# EAGLE design kompass6 (EAGLE 4.16)
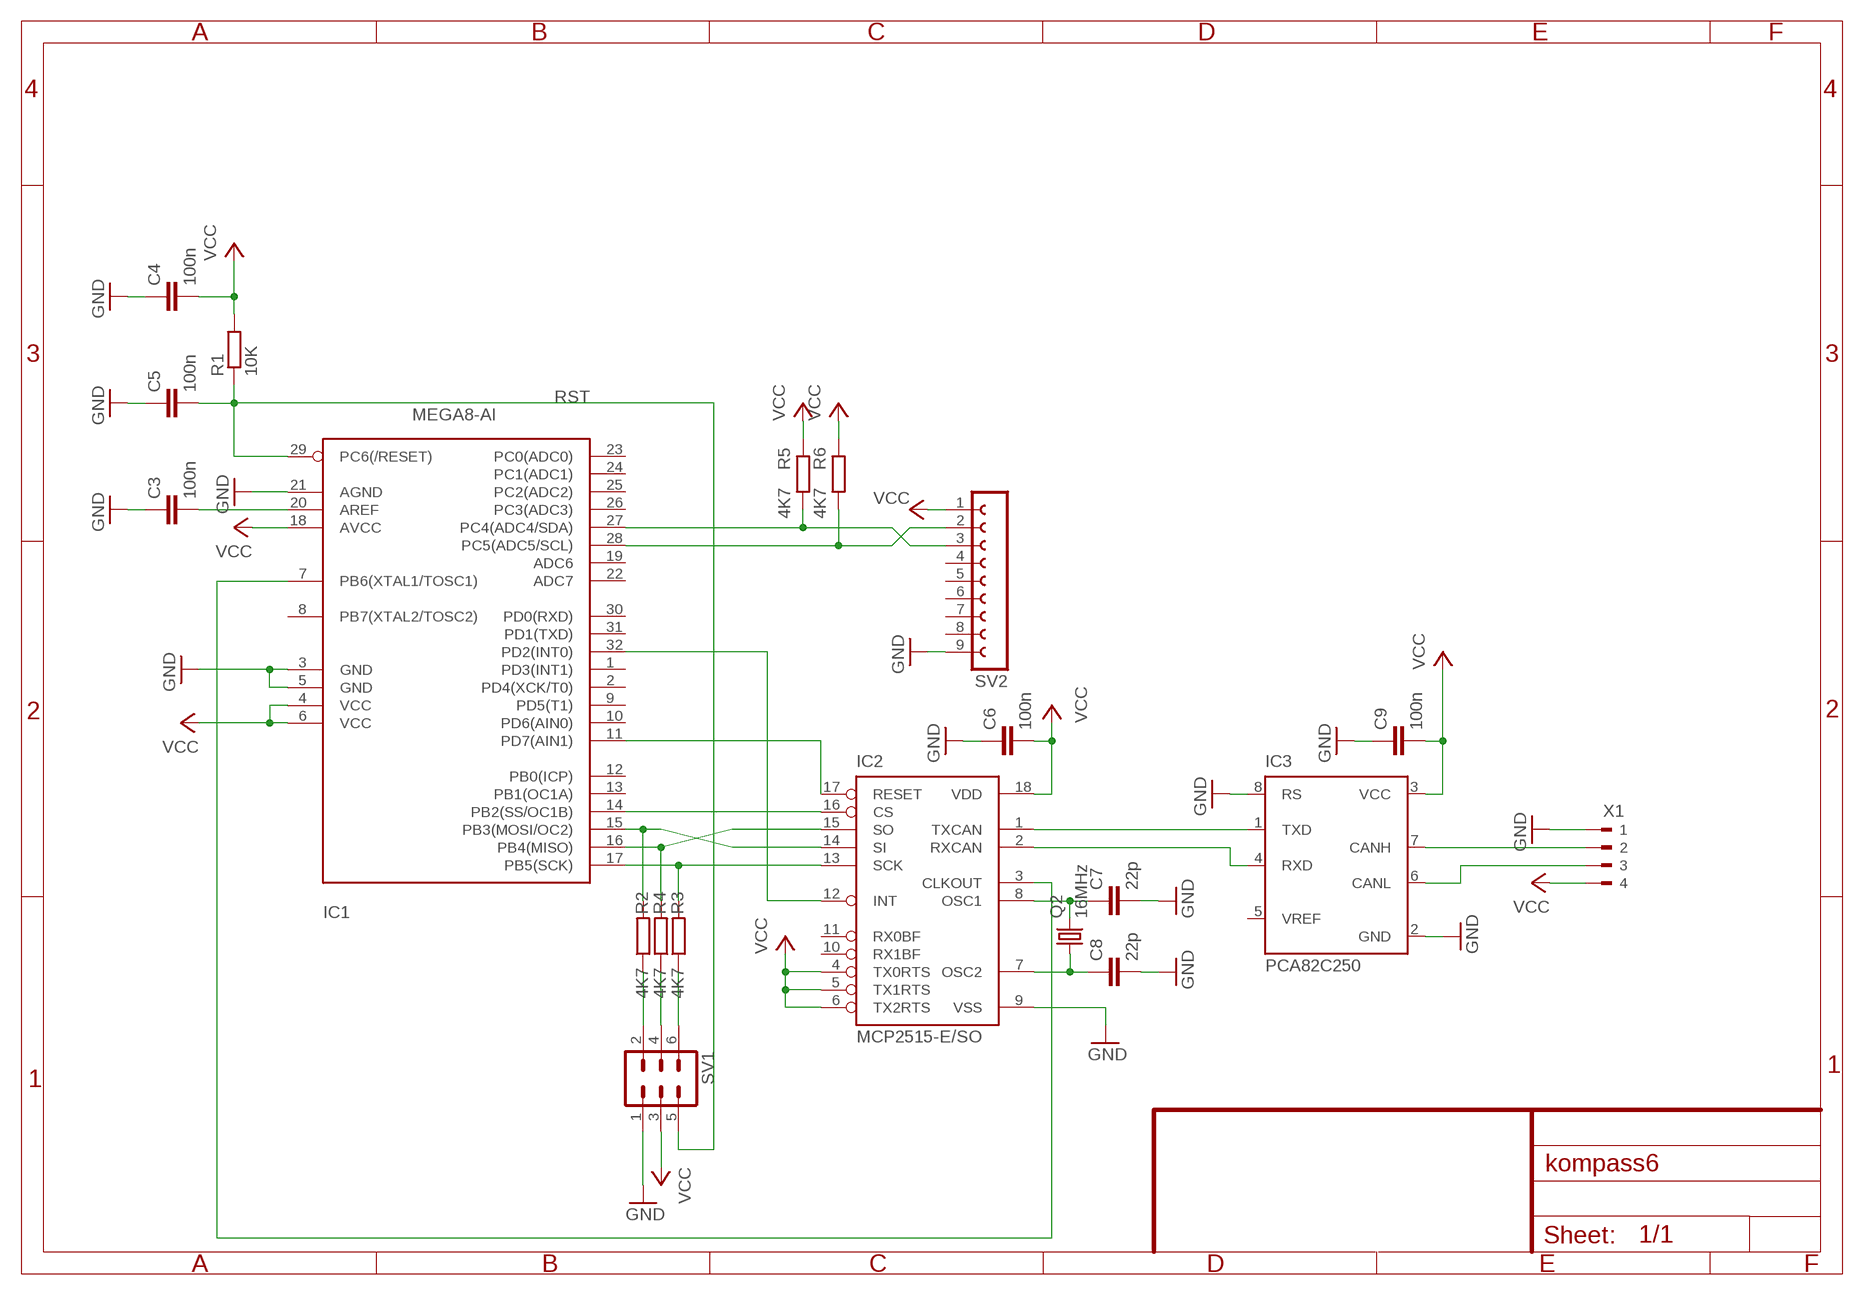
[diagram p0: schematic, sheet 1]

## Parts
C3  100n  C-EUC0603  [C0603]
C4  100n  C-EUC0603  [C0603]
C5  100n  C-EUC0603  [C0603]
C6  100n  C-EUC0603  [C0603]
C7  22p  C-EUC0603  [C0603]
C8  22p  C-EUC0603  [C0603]
C9  100n  C-EUC0603  [C0603]
IC1  MEGA8-AI  [TQFP32-08]
IC2  MCP2515-E/SO  [SO18L]
IC3  PCA82C250  [DIL08]
Q2  16MHz  CRYSTALHC49U-V  [HC49U-V]
R1  10K  R-EU_R0805  [R0805]
R2  4K7  R-EU_R0805  [R0805]
R3  4K7  R-EU_R0805  [R0805]
R4  4K7  R-EU_R0805  [R0805]
R5  4K7  R-EU_R0805  [R0805]
R6  4K7  R-EU_R0805  [R0805]
SV1  MA03-2  [MA03-2]
SV2  FE09-1  [FE09]
X1  90-4  [90-4]

## Nets
GND: C3.1 C4.1 C5.1 C6.1 C7.2 C8.2 C9.1 IC1.3(GND) IC1.5(GND) IC1.21(AGND) IC2.9(VSS) IC3.2(GND) IC3.8(RS) SV1.1 SV2.9 X1.1
INT: IC1.32(PD2(INT0)) IC2.12(INT)
MISO: IC1.16(PB4(MISO)) IC2.15(SO) R4.2
MOSI: IC1.15(PB3(MOSI/OC2)) IC2.14(SI) R2.2
N$1: IC3.7(CANH) X1.2
N$2: IC3.6(CANL) X1.3
N$5: C3.2 IC1.20(AREF)
N$6: IC1.11(PD7(AIN1)) IC2.17(RESET)
N$8: IC1.7(PB6(XTAL1/TOSC1)) IC2.3(CLKOUT)
N$11: IC2.1(TXCAN) IC3.1(TXD)
N$12: IC2.2(RXCAN) IC3.4(RXD)
N$13: C7.1 IC2.8(OSC1) Q2.2
N$14: C8.1 IC2.7(OSC2) Q2.1
N$15: R2.1 SV1.2
N$16: R3.1 SV1.6
N$17: R4.1 SV1.4
RST: C5.2 IC1.29(PC6(/RESET)) R1.1 SV1.5
SCK: IC1.17(PB5(SCK)) IC2.13(SCK) R3.2
SCL: IC1.28(PC5(ADC5/SCL)) R6.1 SV2.2
SDA: IC1.27(PC4(ADC4/SDA)) R5.1 SV2.3
SS: IC1.14(PB2(SS/OC1B)) IC2.16(CS)
VCC: C4.2 C6.2 C9.2 IC1.4(VCC) IC1.6(VCC) IC1.18(AVCC) IC2.4(TX0RTS) IC2.5(TX1RTS) IC2.6(TX2RTS) IC2.18(VDD) IC3.3(VCC) R1.2 R5.2 R6.2 SV1.3 SV2.1 X1.4
Unconnected: IC1.1(PD3(INT1)) IC1.2(PD4(XCK/T0)) IC1.8(PB7(XTAL2/TOSC2)) IC1.9(PD5(T1)) IC1.10(PD6(AIN0)) IC1.12(PB0(ICP)) IC1.13(PB1(OC1A)) IC1.19(ADC6) IC1.22(ADC7) IC1.23(PC0(ADC0)) IC1.24(PC1(ADC1)) IC1.25(PC2(ADC2)) IC1.26(PC3(ADC3)) IC1.30(PD0(RXD)) IC1.31(PD1(TXD)) IC2.10(RX1BF) IC2.11(RX0BF) IC3.5(VREF) SV2.4 SV2.5 SV2.6 SV2.7 SV2.8

## Library data of the parts
C3-C9 = rcl:C-EU: CAPACITOR, European symbol
IC1 = atmel:MEGA8: MICROCONTROLLER 8 Kbytes FLASH 1 kbytes SRAM 512 bytes EEPROM USART 6-channel 10 bit ADC 2-channel 8 bit ADC Source: avr.lbr
IC2 = mcp2515:MCP2515
IC3 = micro-philips:PCA82C250: CAN CONTROLLER INTERFACE
Q2 = crystal:CRYSTAL: CRYSTAL
R1-R6 = rcl:R-EU_: RESISTOR, European symbol
SV1 = con-lstb:MA03-2: PIN HEADER
SV2 = con-lsta:FE09-1: FEMALE HEADER
X1 = con-weidmueller-sl35:90-4: WEIDMUELLER CLAMP CONNECTOR

## Board
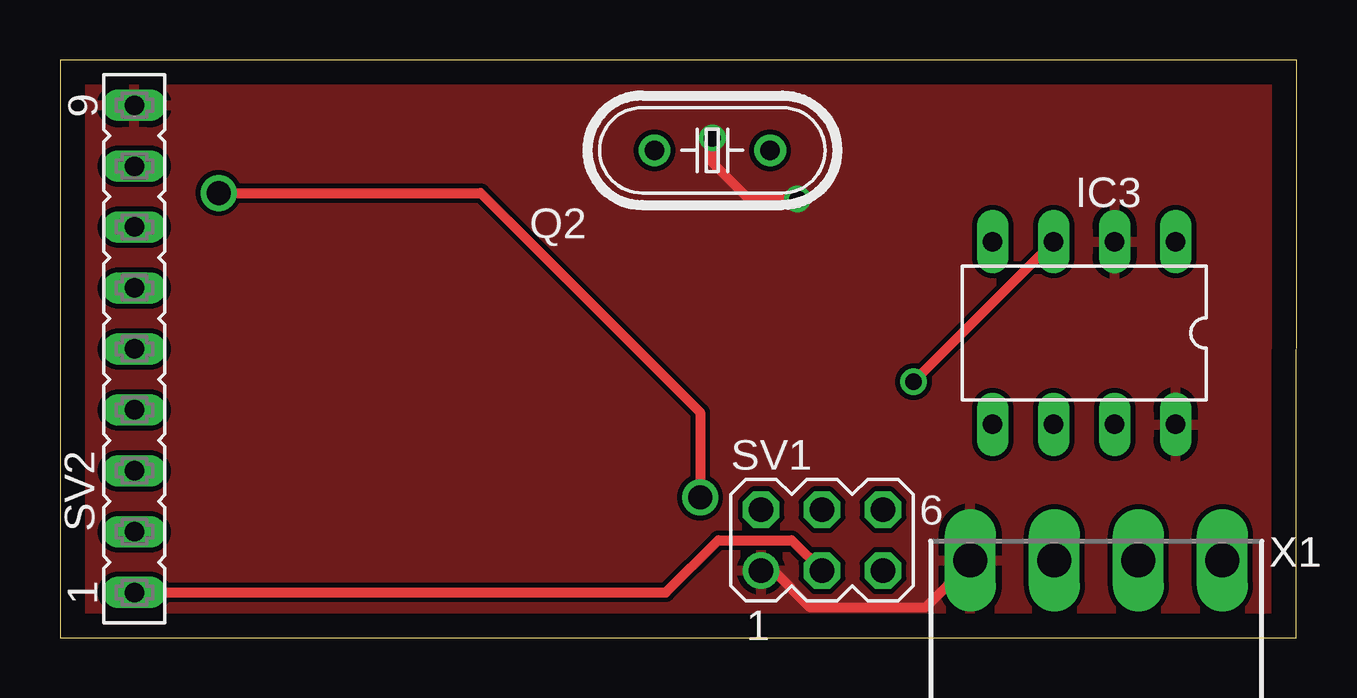
[diagram p1: board, top side]
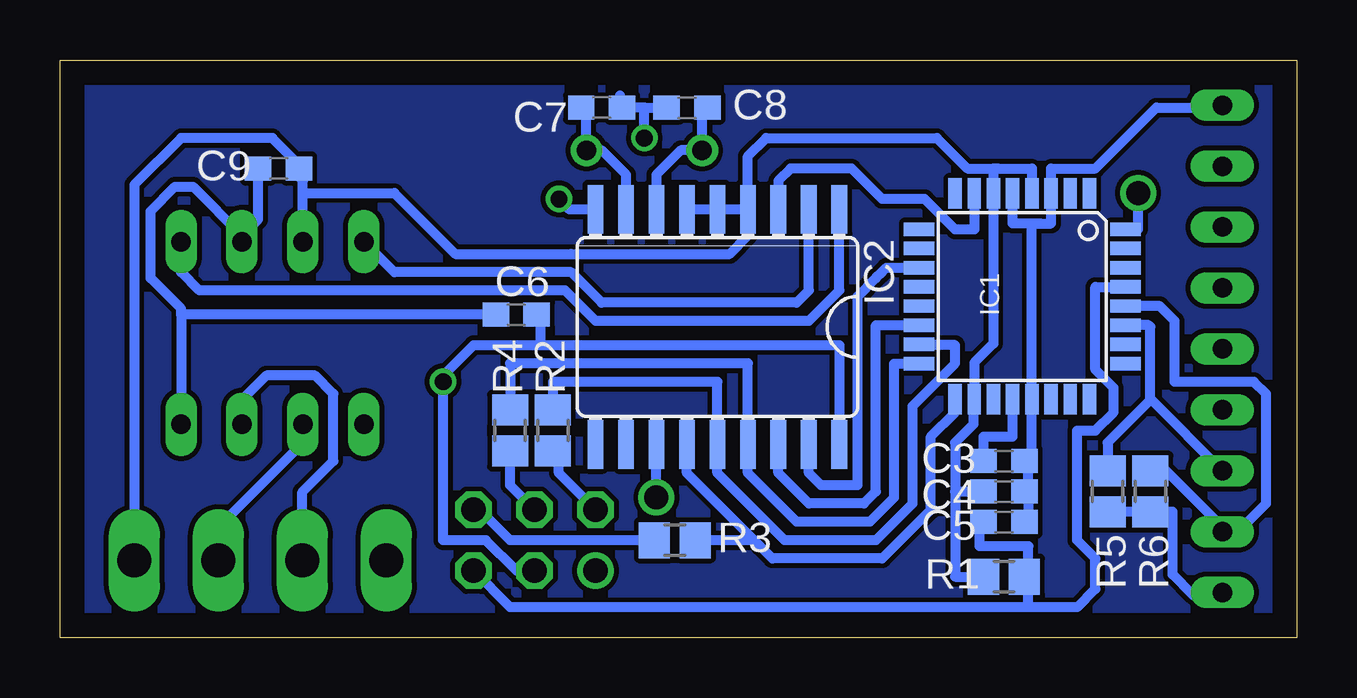
[diagram p2: board, bottom side, seen from below]

Size 51.52 x 24.08 mm. Coordinates in mm from the lower left corner, seen from the top.
Outline: 0,0 51.51,0 51.52,24.08 0,24.08 0,0
Copper layers (1*16): Top 0.035mm / dielectric 1.5mm / Bottom 0.035mm
Design rules "olimex_8mils": minimum track width 10mil, minimum drill 24mil, track to track 8mil, track to pad 8mil, pad to pad 8mil, via to via 8mil, smd to smd 8mil, copper to edge 40mil, drill to drill 10mil, minimum pad ring 10mil, minimum via ring 8mil, stop-mask expansion 0mil, vias tented up to drill 0mil, thermal gap 10mil

### Footprints (pad centres in the part's own frame; a part is rotated, then mirrored left to right if it is on the bottom)
C0603 = smd 1.1 x 1: 1 -0.85,0; 2 0.85,0
TQFP32-08 = smd 1.27 x 0.559: 1 -4.293,2.8; 2 -4.293,2; 3 -4.293,1.2; 4 -4.293,0.4; 5 -4.293,-0.4; 6 -4.293,-1.2; 7 -4.293,-2; 8 -4.293,-2.8; 17 4.293,-2.8; 18 4.293,-2; 19 4.293,-1.2; 20 4.293,-0.4; 21 4.293,0.4; 22 4.293,1.2; 23 4.293,2; 24 4.293,2.8 | smd 0.559 x 1.27: 9 -2.8,-4.293; 10 -2,-4.293; 11 -1.2,-4.293; 12 -0.4,-4.293; 13 0.4,-4.293; 14 1.2,-4.293; 15 2,-4.293; 16 2.8,-4.293; 25 2.8,4.293; 26 2,4.293; 27 1.2,4.293; 28 0.4,4.293; 29 -0.4,4.293; 30 -1.2,4.293; 31 -2,4.293; 32 -2.8,4.293
SO18L = smd 0.66 x 2.032: 1 -5.08,-4.902; 2 -3.81,-4.902; 3 -2.54,-4.902; 4 -1.27,-4.902; 5 0,-4.902; 6 1.27,-4.902; 7 2.54,-4.902; 8 3.81,-4.902; 9 5.08,-4.902; 10 5.08,4.902; 11 3.81,4.902; 12 2.54,4.902; 13 1.27,4.902; 14 0,4.902; 15 -1.27,4.902; 16 -2.54,4.902; 17 -3.81,4.902; 18 -5.08,4.902
DIL08 = drill 0.813 long: 1 -3.81,-3.81; 2 -1.27,-3.81; 3 1.27,-3.81; 4 3.81,-3.81; 5 3.81,3.81; 6 1.27,3.81; 7 -1.27,3.81; 8 -3.81,3.81
HC49U-V = drill 0.813 round: 1 -2.413,0; 2 2.413,0
R0805 = smd 1.3 x 1.5: 1 -0.85,0; 2 0.85,0
MA03-2 = drill 1.016 round: 1 -2.54,-1.27 | drill 1.016 octagon: 2 -2.54,1.27; 3 0,-1.27; 4 0,1.27; 5 2.54,-1.27; 6 2.54,1.27
FE09 = drill 0.813 long: 1 -10.16,0; 2 -7.62,0; 3 -5.08,0; 4 -2.54,0; 5 0,0; 6 2.54,0; 7 5.08,0; 8 7.62,0; 9 10.16,0
90-4 = drill 1.422 long: 1 -5.25,5.25; 2 -1.75,5.25; 3 1.75,5.25; 4 5.25,5.25

### Placement (x,y rotation side)
C3  12.19,7.36 180 bottom
C4  12.19,6.09 180 bottom
C5  12.19,4.82 180 bottom
C6  32.51,13.46 0 bottom
C7  28.96,22.1 0 bottom
C8  25.4,22.1 180 bottom
C9  42.42,19.56 0 bottom
IC1  11.43,14.22 270 bottom
IC2  24.13,12.95 180 bottom
IC3  42.67,12.7 180 top
Q2  27.18,20.32 0 top
R1  12.19,2.54 180 bottom
R2  30.99,8.63 90 bottom
R3  25.91,4.06 0 bottom
R4  32.77,8.63 90 bottom
R5  7.87,6.09 270 bottom
R6  6.1,6.09 270 bottom
SV1  31.75,4.06 0 top
SV2  3.1,12.04 90 top
X1  43.18,-2.03 0 top

### Tracks (layer width: path | path; a pad name or v marks a point on that pad's centre or on a via)
GND  (via drill 0.7)
  Top 0.406: SV1.1 29.72,2.79 31.24,1.27 36.07,1.27 37.85,3.05 37.93,3.13 X1.1 | v30.73,18.29 28.7,18.29 27.18,19.81 v27.18,20.83
  Bottom 0.406: IC1.5 11.83,17.27 10.67,17.27 | 10.67,17.27 10.23,17.27 IC1.3 10.23,19.56 8.38,19.56 5.84,22.1 3.05,22.1 3.1,22.14 SV2.9 | 10.67,17.27 11.03,17.27 IC1.21 11.03,7.22 11.18,7.22 11.18,7.11 | C5.1 11.18,4.82 11.18,6.09 | 11.18,7.36 C3.1 | C4.1 11.18,6.09 | 11.18,6.09 11.18,7.11 | 11.18,7.11 11.18,7.36 | 11.18,7.11 11.18,7.36 | 28.19,22.1 C7.2 | 27.18,22.1 28.19,22.1 | 27.18,22.1 C8.2 | 46.48,13.46 IC3.8 | 46.48,13.46 46.48,13.71 47.75,14.98 47.75,17.78 46.74,18.79 45.97,18.79 43.94,16.76 | 43.94,16.76 IC3.2 43.94,16.76 | C9.1 43.27,17.44 43.94,16.76 | C6.1 46.48,13.46 | 28.19,22.1 28.19,22.6 | v27.18,20.83 27.18,22.1 | IC2.9 30.3,17.85 v30.73,18.29
  pour Top: 0,24.13 51.56,24.13 51.56,0 0,0
INT  (via drill 1)
  Top 0.406: v26.67,5.84 26.67,9.4 17.53,18.54 v6.6,18.54
  Bottom 0.406: IC1.32 6.6,17.02 v6.6,18.54 | 26.67,8.13 IC2.12 v26.67,5.84
MISO
  Bottom 0.406: IC1.16 16.76,11.42 16.76,5.84 17.78,4.82 20.83,4.82 22.86,6.86 IC2.15 22.86,11.43 32.77,11.43 R4.2
MOSI
  Bottom 0.406: IC1.15 15.22,12.22 15.24,12.19 14.22,12.19 14.22,11.43 16,9.65 16,9.4 16,5.59 17.53,4.06 21.34,4.06 24.13,6.86 IC2.14 24.13,10.67 30.99,10.67 R2.2
N$1
  Bottom 0.406: X1.2 41.43,6.07 40.13,7.36 40.13,10.16 40.89,10.92 42.93,10.92 43.94,9.9 IC3.7
N$2
  Bottom 0.406: X1.3 44.93,4.6 41.66,7.87 41.66,8.89 IC3.6
N$3
  pour Bottom: 0.25,24.13 51.56,24.13 51.56,0 0,0 0,24.13
N$5
  Bottom 0.406: IC1.20 11.83,9.25 11.83,8.38 12.95,8.38 13.04,8.38 13.04,8.04 C3.2
N$6
  Bottom 0.406: IC2.17 20.32,6.86 19.81,6.35 18.29,6.35 18.29,14.22 17.53,14.98 | 17.53,14.98 17.27,15.24 | IC1.11 17.09,15.42 17.53,14.98
N$8
  Bottom 0.406: IC1.7 13.43,17.02 14.22,17.02 15.49,18.29 16.76,18.29 17.27,18.29 18.54,19.56 21.08,19.56 21.59,19.05 21.59,18.29 IC2.3
N$11
  Bottom 0.406: IC2.1 19.05,14.48 20.32,13.21 29.21,13.21 30.48,14.48 36.83,14.48 45.72,14.48 46.48,15.24 IC3.1
N$12
  Bottom 0.406: IC2.2 20.32,14.48 20.83,13.97 28.96,13.97 30.23,15.24 37.59,15.24 IC3.4
N$13
  Bottom 0.406: IC2.8 27.94,19.3 28.96,20.32 29.46,20.32 Q2.2 29.59,21.72 29.72,21.84 29.81,21.93 C7.1
N$14
  Bottom 0.406: IC2.7 26.67,19.3 25.65,20.32 24.89,20.32 Q2.1 24.77,21.72 24.38,22.1 C8.1
N$15
  Bottom 0.406: R2.1 30.73,7.36 30.73,6.86 SV1.2
N$16
  Bottom 0.406: SV1.6 34.04,5.33 32.77,4.06 27.18,4.06 | R3.1 27.18,4.06 | R3.1 26.67,4.06 | R3.1 27.18,4.06
N$17
  Bottom 0.406: SV1.4 32.77,6.35 R4.1
RST
  Bottom 0.406: IC1.29 8.38,14.62 8.38,11.17 7.62,10.41 7.62,9.4 8.38,8.63 9.14,8.63 9.14,4.06 8.38,3.3 8.38,2.03 9.14,1.27 11.18,1.27 | SV1.5 32.77,1.27 11.18,1.27 | C5.2 13.21,4.82 13.21,3.81 11.18,3.81 11.18,2.54 | 11.18,2.54 R1.1 | 11.18,1.27 11.18,2.54
SCK
  Bottom 0.406: IC1.17 14.23,9.39 15.24,8.38 15.24,5.33 17.27,3.3 21.84,3.3 22.35,3.81 | IC2.13 25.4,6.86 22.35,3.81 | R3.2 22.61,4.06 22.35,3.81
SCL
  Bottom 0.406: IC1.28 5.7,13.82 5.08,13.21 5.08,10.67 1.78,10.67 1.27,10.16 1.27,5.59 2.29,4.57 3.05,4.57 3.1,4.52 SV2.2 3.1,4.62 5.59,7.11 6.1,7.11 | 6.1,7.11 R6.1 | 6.1,7.11 R6.1 | R6.1 6.01,6.86 5.84,6.86 5.84,7.36
SDA
  Bottom 0.406: IC1.27 6.17,13.02 6.1,12.95 6.1,9.9 | 6.1,9.9 7.87,8.13 7.87,6.86 R5.1 | SV2.3 6.04,9.9 6.1,9.9
SS
  Bottom 0.406: IC2.16 21.59,6.86 20.32,5.59 18.03,5.59 17.53,6.09 17.53,13.02 IC1.14
VCC  (via drill 0.7)
  Top 0.406: v35.56,10.67 IC3.3 | SV2.1 25.25,1.88 27.43,4.06 30.48,4.06 SV1.3
  Bottom 0.406: IC2.4 IC2.5 | IC2.5 24.13,17.52 | IC2.5 IC2.6 25.4,17.52 | IC1.4 11.03,19.56 12.45,19.56 | 12.45,19.56 12.63,19.56 IC1.6 12.63,12.26 13.43,11.46 IC1.18 13.46,9.93 13.46,8.89 14.22,8.13 14.22,6.09 | IC2.18 19.05,11.94 19.05,12.19 31.5,12.19 | SV1.3 32.51,2.79 33.78,4.06 35.56,4.06 v35.56,10.67 35.56,10.92 34.29,12.19 31.5,12.19 | R1.2 14.22,2.54 14.22,6.09 | 14.22,6.09 C4.2 | C6.2 31.5,13.29 31.5,12.19 | R5.2 7.87,5.08 7.71,5.24 R6.2 5.17,5.24 5.17,2.63 4.32,1.78 3.3,1.78 | 3.2,1.88 3.3,1.78 | IC3.3 41.4,18.54 | 41.4,18.54 41.4,19.05 41.91,19.56 C9.2 41.4,19.56 42.67,20.83 46.48,20.83 48.43,18.88 X1.4 | IC2.4 22.86,16.76 23.62,16 30.23,16 35.05,16 37.59,18.54 41.4,18.54 | 12.45,19.56 13.72,19.56 14.99,20.83 22.1,20.83 22.86,20.06 22.86,18.54 22.86,18.03 IC2.4 | 3.2,1.88 3.3,1.78 | SV2.1 3.2,1.88

### Text on the board
_tNames: IC3 | Q2 | SV1 | SV2 | X1
_bNames: C7 | C8 | C9 | IC2 | IC1 | C6 | R2 | R5 | C3 | R4 | C4 | R3 | R6 | C5 | R1